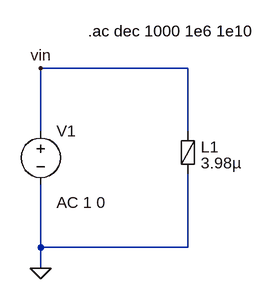
[diagram p0: schematic ferrite_bead.asc]
ferrite_bead.asc, the LTspice schematic file:
Version 4
SHEET 1 880 680
WIRE 128 -16 -96 -16
WIRE -96 80 -96 -16
WIRE 128 80 128 -16
WIRE -96 256 -96 160
WIRE 128 256 128 144
WIRE 128 256 -96 256
WIRE -96 288 -96 256
FLAG -96 288 0
FLAG -96 -16 vin
SYMBOL FerriteBead 128 112 R0
SYMATTR InstName L1
SYMATTR Value 3.98µ
SYMATTR SpiceLine Rser=2 Rpar=2800 Cpar=25f
SYMBOL voltage -96 64 R0
WINDOW 123 24 124 Left 2
WINDOW 39 0 0 Left 0
SYMATTR InstName V1
SYMATTR Value ""
SYMATTR Value2 AC 1 0
TEXT -24 -72 Left 2 !.ac dec 1000 1e6 1e10

The netlist it stands for:
* ferrite_bead.asc
L1 vin 0 3.98µ Rser=2 Rpar=2800 Cpar=25f
V1 vin 0 AC 1 0
.ac dec 1000 1e6 1e10
.backanno
.end